# Altium schematic sheet bridge_leg.SchDoc
size A4; SheetNumber: 2; SheetTotal: 3
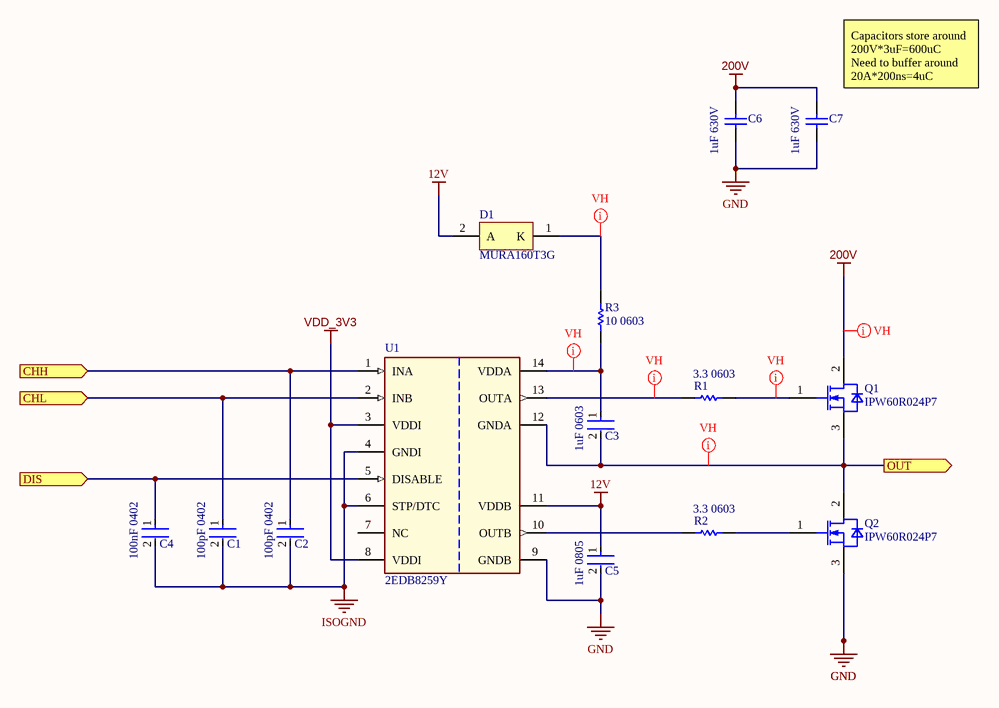
[diagram p0: bridge_leg.SchDoc]

## Parts
C1  100pF 0402  [CAP 0402_1005 RF]
C2  100pF 0402  [CAP 0402_1005 RF]
C3  1uF 0603  [CAP 0805_2012]
C4  100nF 0402  [CAP 0402_1005 RF]
C5  1uF 0805  [CAP 0805_2012]
C6  1uF 630V  [CAP 2220_5650 2.5MM]
C7  1uF 630V  [CAP 2220_5650 2.5MM]
D1  MURA160T3G  [ONSC-SMA-2-403D-02_V]
Q1  IPW60R024P7  [INF-PG-TO247-3]
Q2  IPW60R024P7  [INF-PG-TO247-3]
R1  3.3 0603  [RES 0603_1608]
R2  3.3 0603  [RES 0603_1608]
R3  10 0603  [RES 0603_1608]
U1  2EDB8259Y  [SOIC127P600X175-16_14N-1-V]

## Ports
CHH (in), CHL (in), DIS (in), OUT (out)

## Nets
12V: C5.1 D1.2(A) U1.11(VDDB)
200V: C6.2 C7.2 Q1.2(DRAIN)
GND: C5.2 C6.1 C7.1 Q2.3(SOURCE) U1.9(GNDB)
ISOGND: C1.2 C2.2 C4.2 U1.4(GNDI) U1.6(STP/DTC)
VDD_3V3: U1.3(VDDI) U1.8(VDDI)
CHH: C2.1 U1.1(INA) ; port CHH
CHL: C1.1 U1.2(INB) ; port CHL
DIS: C4.1 U1.5(DISABLE) ; port DIS
OUT: C3.2 Q1.3(SOURCE) Q2.2(DRAIN) U1.12(GNDA) ; port OUT
NetC3_1: C3.1 R3.1 U1.14(VDDA)
NetD1_1: D1.1(K) R3.2
NetQ1_1: Q1.1(GATE) R1.2
NetQ2_1: Q2.1(GATE) R2.2
NetR1_1: R1.1 U1.13(OUTA)
NetR2_1: R2.1 U1.10(OUTB)

Not connected (* = marked no-connect by the designer): U1 7(NC)

## Layout directives
net class VH: 200V, NetC3_1, NetD1_1, NetQ1_1, NetR1_1, OUT

## Notes on the sheet
- (near C7) Capacitors store around 200V*3uF=600uC
  Need to buffer around 20A*200ns=4uC

## Library data of the parts
C1 C2 C4 = b4654b650e69147ec39a6b967a45e02: MLCC 0402 100pF; Voltage: 50V; Tolerance: 5%; Dielectric: C0G; Insulation Resistance: 1GR; Dissipation Factor: 2.5%; Temperature Coefficient: 30ppm/°C; REACH SVHC: No SVHC; Termination: SMD/SMT; Construction: Flat; Contact Plating: Tin; Width: 0.02inch; Series: -; Voltage Rating (DC): 50V; Voltage Rating: 50V; Height: 0.56mm; Max Operating Temperature: 125°C; Length: 1mm; Lead Free: Lead Free; Case/Package: 0402; Min Operating Temperature: -55°C; Depth: 0.5mm; Case Code (Metric): 1005; Thickness: 0.022inch; Radiation Hardening: No; Case Code (Imperial): 0402; Mount: Surface Mount; Capacitance: 100pF; Packaging: Tape and Reel; Package Quantity: 1; RoHS Compliant: Yes
  C4: Supplier 1: Future Electronics; Supplier Part Number 1: 5964861
C3 C5 = b4654b650e69147ec39a6b967a45e02: MLCC 0805 1uF; Voltage: 50V; Tolerance: 5%; Dielectric: C0G; Insulation Resistance: 1GR; Dissipation Factor: 2.5%; Temperature Coefficient: 30ppm/°C; REACH SVHC: No SVHC; Termination: SMD/SMT; Construction: Flat; Contact Plating: Tin; Width: 0.02inch; Series: -; Voltage Rating (DC): 50V; Voltage Rating: 50V; Height: 0.56mm; Max Operating Temperature: 125°C; Length: 1mm; Lead Free: Lead Free; Case/Package: 0402; Min Operating Temperature: -55°C; Depth: 0.5mm; Case Code (Metric): 1005; Thickness: 0.022inch; Radiation Hardening: No; Case Code (Imperial): 0402; Mount: Surface Mount; Capacitance: 1uF; Packaging: Tape and Reel; Package Quantity: 1; RoHS Compliant: Yes; Supplier 1: Mouser; Supplier Part Number 1: 80-C0603C105K3R
C6 C7 = Capacitor_Non-Polarized: MLCC 1Uf, 630V, Mlcc, 2220 Rohs Compliant: Yes; NexarPartId: 133607636; Capacitance: 1µF; Insulation Resistance: 100MΩ; RoHS: Compliant; Length: 5.7mm; Height: 5mm; Min Operating Temperature: -55°C; Width: 2.8mm; Voltage Rating: 630V; Max Operating Temperature: 125°C; Supplier 1: Rs; Supplier Part Number 1: 2610080
D1 = CMP-0894-00005-3: Surface Mount Ultrafast Power Rectifier, 2-Pin SMA, Pb-Free, Tape and Reel; Manufacturer: On Semiconductor; IFSM Max (A): 30; VRRM Max (V): 600; Type: Ultrafast; ComponentLink1URL: http://www.onsemi.com/; PackageDescription: 2-Pin Small Molded Package, J-Bend Lead, Body 2.605 x 4.315 mm; ComponentLink3Description: Package Specification; ComponentLink2Description: Datasheet; PartNumber: MURA160T3G; RoHS: TRUE; ComponentLink2URL: http://www.onsemi.cn/pub_link/Collateral/MURA160T3-D.PDF; ComponentLink1Description: Manufacturer URL; Packing: Tape and Reel; PackageReference: SMA-2-403D-02; ComponentLink3URL: http://www.onsemi.com/pub_link/Collateral/403D-02.PDF; PackageVersion: Rev. G, 07/2012; Mounting Technology: Surface Mount; DatasheetVersion: Rev. 6
Q1 Q2 = IPW60R024P7: Smart Low Side Power Switch; Manufacturer: Infineon Technologies; Manufacturer Order Number: IPW60R024P7; PackageReference: PG-TO247-3-41; Supplier 1: Mouser; Supplier Part Number 1: 726-IPW60R024P7XKSA1
R1 R2 = Res1: Resistor 3.3Ohm 0603; Value: 3.3; Published: 8-Jun-2000; LatestRevisionDate: 17-Jul-2002; LatestRevisionNote: Re-released for DXP Platform.; PackageReference: AXIAL-0.3; Publisher: Altium Limited; PackageDescription: Axial Device, Thru-Hole; 2 Leads; 0.3 in Pin Spacing
R3 = Res1: Resistor 10Ohm 0603; Value: 10; Published: 8-Jun-2000; LatestRevisionDate: 17-Jul-2002; LatestRevisionNote: Re-released for DXP Platform.; PackageReference: AXIAL-0.3; Publisher: Altium Limited; PackageDescription: Axial Device, Thru-Hole; 2 Leads; 0.3 in Pin Spacing; Supplier 1: Mouser; Supplier Part Number 1: 71-CRCW0603-10-E3
U1 = 2EDB8259Y: Dual-Channel Isolated Gate Driver; Manufacturer: Infineon Technologies; Manufacturer Order Number: 2EDB8259Y; PackageReference: PG-DSO-14; Supplier 1: Mouser; Supplier Part Number 1: 726-2EDB8259YXUMA1